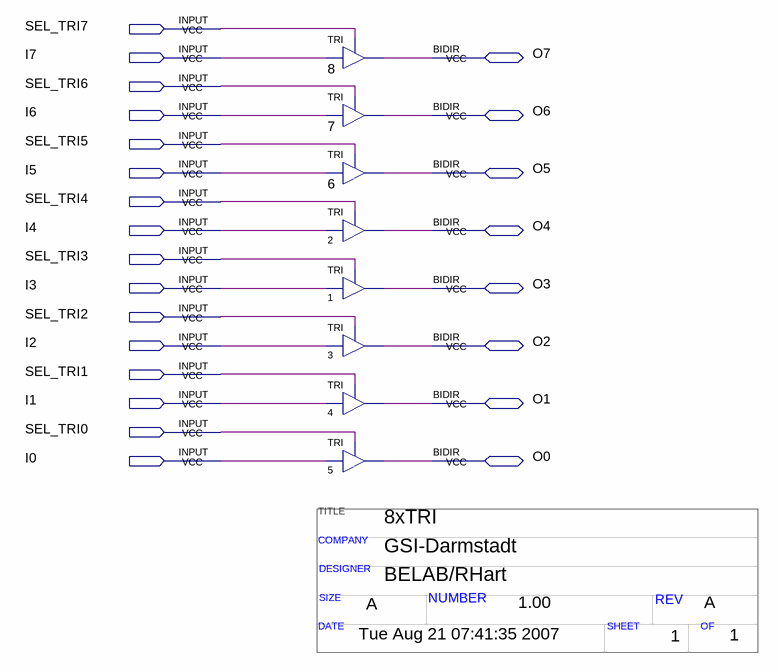
[diagram p0: schematic sheet]
// Quartus schematic 8xtri.bdf as structural Verilog: 8 symbols, 24 pins
// Title block: TITLE: 8xTRI; COMPANY: GSI-Darmstadt; DESIGNER: BELAB/RHart; SIZE: A; NUMBER: 1.00; REV: A; DATE: Tue Aug 21 07:41:35 2007; SHEET: 1; OF: 1
module \8xtri  (
  input  SEL_TRI7,
  input  I7,
  input  SEL_TRI6,
  input  I6,
  input  SEL_TRI5,
  input  I5,
  input  SEL_TRI4,
  input  I4,
  input  SEL_TRI3,
  input  I3,
  input  SEL_TRI2,
  input  I2,
  input  SEL_TRI1,
  input  I1,
  input  SEL_TRI0,
  input  I0,
  inout  O7,
  inout  O6,
  inout  O5,
  inout  O4,
  inout  O3,
  inout  O2,
  inout  O1,
  inout  O0
);

  TRI u_8 (.IN(I7), .OE(SEL_TRI7), .OUT(O7));
  TRI u_7 (.IN(I6), .OE(SEL_TRI6), .OUT(O6));
  TRI u_6 (.IN(I5), .OE(SEL_TRI5), .OUT(O5));
  TRI u_2 (.IN(I4), .OE(SEL_TRI4), .OUT(O4));
  TRI u_1 (.IN(I3), .OE(SEL_TRI3), .OUT(O3));
  TRI u_3 (.IN(I2), .OE(SEL_TRI2), .OUT(O2));
  TRI u_4 (.IN(I1), .OE(SEL_TRI1), .OUT(O1));
  TRI u_5 (.IN(I0), .OE(SEL_TRI0), .OUT(O0));
endmodule
